# Altium schematic sheet Sensor.SchDoc
size A3
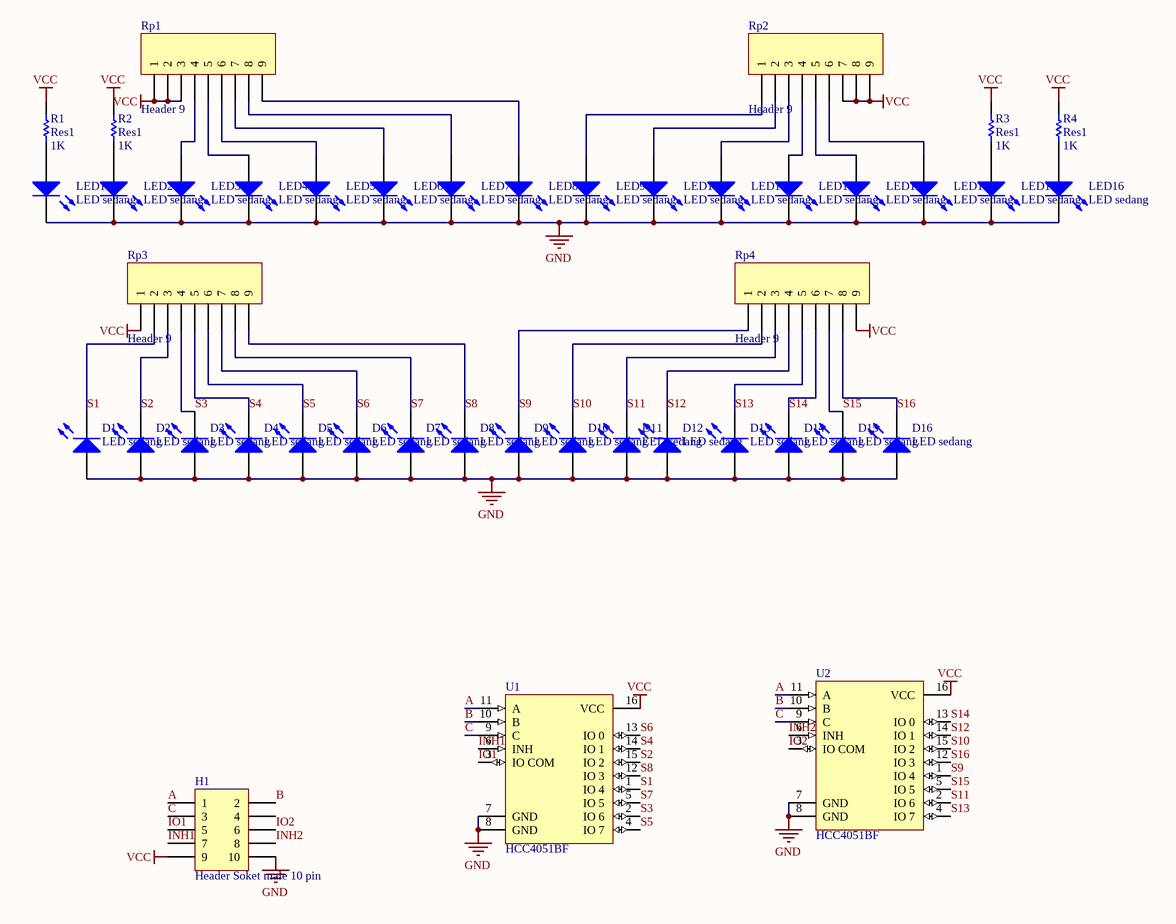
[diagram p0: Sensor.SchDoc]

## Parts
D1  LED sedang  [LED sedang]
D2  LED sedang  [LED sedang]
D3  LED sedang  [LED sedang]
D4  LED sedang  [LED sedang]
D5  LED sedang  [LED sedang]
D6  LED sedang  [LED sedang]
D7  LED sedang  [LED sedang]
D8  LED sedang  [LED sedang]
D9  LED sedang  [LED sedang]
D10  LED sedang  [LED sedang]
D11  LED sedang  [LED sedang]
D12  LED sedang  [LED sedang]
D13  LED sedang  [LED sedang]
D14  LED sedang  [LED sedang]
D15  LED sedang  [LED sedang]
D16  LED sedang  [LED sedang]
H1  Header Soket male 10 pin  [Header Soket male 10 pin]
LED1  LED sedang  [LED sedang]
LED2  LED sedang  [LED sedang]
LED3  LED sedang  [LED sedang]
LED4  LED sedang  [LED sedang]
LED5  LED sedang  [LED sedang]
LED6  LED sedang  [LED sedang]
LED7  LED sedang  [LED sedang]
LED8  LED sedang  [LED sedang]
LED9  LED sedang  [LED sedang]
LED10  LED sedang  [LED sedang]
LED11  LED sedang  [LED sedang]
LED12  LED sedang  [LED sedang]
LED13  LED sedang  [LED sedang]
LED14  LED sedang  [LED sedang]
LED15  LED sedang  [LED sedang]
LED16  LED sedang  [LED sedang]
R1  Res1  value 1K  [AXIAL-0.3]
R2  Res1  value 1K  [AXIAL-0.3]
R3  Res1  value 1K  [AXIAL-0.3]
R4  Res1  value 1K  [AXIAL-0.3]
Rp1  Header 9  [HDR1X9]
Rp2  Header 9  [HDR1X9]
Rp3  Header 9  [HDR1X9]
Rp4  Header 9  [HDR1X9]
U1  HCC4051BF  [DIP16]
U2  HCC4051BF  [DIP16]

## Nets
GND: D1.1(A) D2.1(A) D3.1(A) D4.1(A) D5.1(A) D6.1(A) D7.1(A) D8.1(A) D9.1(A) D10.1(A) D11.1(A) D12.1(A) D13.1(A) D14.1(A) D15.1(A) D16.1(A) H1.10 LED1.2(K) LED2.2(K) LED3.2(K) LED4.2(K) LED5.2(K) LED6.2(K) LED7.2(K) LED8.2(K) LED9.2(K) LED10.2(K) LED11.2(K) LED12.2(K) LED13.2(K) LED14.2(K) LED15.2(K) LED16.2(K) U1.7(GND) U1.8(GND) U2.7(GND) U2.8(GND)
VCC: H1.9 R1.2 R2.2 R3.2 R4.2 Rp1.1 Rp1.2 Rp1.3 Rp2.7 Rp2.8 Rp2.9 Rp3.1 Rp4.9 U1.16(VCC) U2.16(VCC)
A: H1.1 U1.11(A) U2.11(A)
B: H1.2 U1.10(B) U2.10(B)
C: H1.3 U1.9(C) U2.9(C)
INH1: H1.7 U1.6(INH)
INH2: H1.8 U2.6(INH)
IO1: H1.5 U1.3(IO_COM)
IO2: H1.6 U2.3(IO_COM)
S1: D1.2(K) Rp3.2 U1.1(IO_4)
S2: D2.2(K) Rp3.3 U1.15(IO_2)
S3: D3.2(K) Rp3.4 U1.2(IO_6)
S4: D4.2(K) Rp3.5 U1.14(IO_1)
S5: D5.2(K) Rp3.6 U1.4(IO_7)
S6: D6.2(K) Rp3.7 U1.13(IO_0)
S7: D7.2(K) Rp3.8 U1.5(IO_5)
S8: D8.2(K) Rp3.9 U1.12(IO_3)
S9: D9.2(K) Rp4.1 U2.1(IO_4)
S10: D10.2(K) Rp4.2 U2.15(IO_2)
S11: D11.2(K) Rp4.3 U2.2(IO_6)
S12: D12.2(K) Rp4.4 U2.14(IO_1)
S13: D13.2(K) Rp4.5 U2.4(IO_7)
S14: D14.2(K) Rp4.6 U2.13(IO_0)
S15: D15.2(K) Rp4.7 U2.5(IO_5)
S16: D16.2(K) Rp4.8 U2.12(IO_3)
NetLED1_1: LED1.1(A) R1.1
NetLED2_1: LED2.1(A) R2.1
NetLED3_1: LED3.1(A) Rp1.4
NetLED4_1: LED4.1(A) Rp1.5
NetLED5_1: LED5.1(A) Rp1.6
NetLED6_1: LED6.1(A) Rp1.7
NetLED7_1: LED7.1(A) Rp1.8
NetLED8_1: LED8.1(A) Rp1.9
NetLED9_1: LED9.1(A) Rp2.1
NetLED10_1: LED10.1(A) Rp2.2
NetLED11_1: LED11.1(A) Rp2.3
NetLED12_1: LED12.1(A) Rp2.4
NetLED13_1: LED13.1(A) Rp2.5
NetLED14_1: LED14.1(A) Rp2.6
NetLED15_1: LED15.1(A) R3.1
NetLED16_1: LED16.1(A) R4.1

Not connected (* = marked no-connect by the designer): H1 4

## Notes on the sheet
- Title
- Size:
- Date:
- A3
- Number:
- Time:
- Revision:
- Sheet
- of
- File:

## Library data of the parts
R1-R4 = Res1: Resistor; Published: 8-Jun-2000; LatestRevisionDate: 17-Jul-2002; LatestRevisionNote: Re-released for DXP Platform.; PackageReference: AXIAL-0.3; Publisher: Altium Limited; PackageDescription: Axial Device, Thru-Hole; 2 Leads; 0.3 in Pin Spacing
Rp1-Rp4 = Header 9: Header, 9-Pin; LatestRevisionDate: 17-Jul-2002; LatestRevisionNote: Re-released for DXP Platform.; Publisher: Altium Limited
U1 U2 = HCC4051BF: Analog Multiplexer/Demultiplexer; Published: 8-Jun-2000; LatestRevisionDate: 06-Jun-2005; LatestRevisionNote: Stylized 3D Model Added.; DatasheetVersion: Jun-1989; PackageVersion: Apr-1996; PackageReference: DIP16; Publisher: Altium Limited; PackageDescription: DIP; 16 Leads; Row Spacing 7.62 mm; Pitch 2.54 mm; ComponentLink1Description: Manufacturer Link; ComponentLink1URL: http://www.st.com/